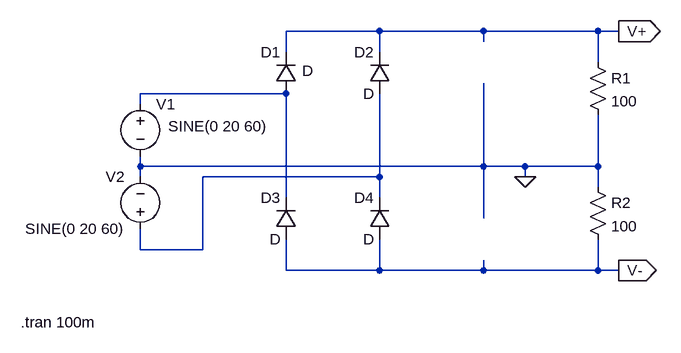
[diagram p0: schematic Draft1.asc]
Draft1.asc, the LTspice schematic file:
Version 4
SHEET 1 924 680
WIRE 464 32 320 32
WIRE 624 32 464 32
WIRE 800 32 624 32
WIRE 832 32 800 32
WIRE 624 48 624 32
WIRE 320 64 320 32
WIRE 464 64 464 32
WIRE 800 80 800 32
WIRE 320 128 96 128
WIRE 96 144 96 128
WIRE 96 240 96 224
WIRE 624 240 624 112
WIRE 624 240 96 240
WIRE 688 240 624 240
WIRE 800 240 800 160
WIRE 800 240 688 240
WIRE 96 256 96 240
WIRE 464 256 464 128
WIRE 464 256 192 256
WIRE 688 256 688 240
WIRE 800 272 800 240
WIRE 320 288 320 128
WIRE 464 288 464 256
WIRE 624 320 624 240
WIRE 96 368 96 336
WIRE 192 368 192 256
WIRE 192 368 96 368
WIRE 320 400 320 352
WIRE 464 400 464 352
WIRE 464 400 320 400
WIRE 624 400 624 384
WIRE 624 400 464 400
WIRE 800 400 800 352
WIRE 800 400 624 400
WIRE 832 400 800 400
FLAG 688 256 0
FLAG 832 32 V+
IOPIN 832 32 Out
FLAG 832 400 V-
IOPIN 832 400 Out
SYMBOL voltage 96 128 R0
WINDOW 3 43 50 Left 2
WINDOW 123 0 0 Left 0
WINDOW 39 0 0 Left 0
SYMATTR InstName V1
SYMATTR Value SINE(0 20 60)
SYMBOL voltage 96 352 R180
WINDOW 0 24 96 Left 2
WINDOW 3 24 16 Left 2
WINDOW 123 0 0 Left 0
WINDOW 39 0 0 Left 0
SYMATTR InstName V2
SYMATTR Value SINE(0 20 60)
SYMBOL diode 336 128 R180
WINDOW 0 24 64 Left 2
WINDOW 3 -26 35 Left 2
SYMATTR InstName D1
SYMBOL diode 480 128 R180
WINDOW 0 24 64 Left 2
WINDOW 3 24 0 Left 2
SYMATTR InstName D2
SYMBOL diode 336 352 R180
WINDOW 0 24 64 Left 2
WINDOW 3 24 0 Left 2
SYMATTR InstName D3
SYMBOL diode 480 352 R180
WINDOW 0 24 64 Left 2
WINDOW 3 24 0 Left 2
SYMATTR InstName D4
SYMBOL res 784 64 R0
SYMATTR InstName R1
SYMATTR Value 100
SYMBOL res 784 256 R0
SYMATTR InstName R2
SYMATTR Value 100
TEXT -88 480 Left 2 !.tran 100m

The netlist it stands for:
* Draft1.asc
V1 N001 0 SINE(0 20 60)
V2 N002 0 SINE(0 20 60)
D1 N001 V+ D
D2 N002 V+ D
D3 V- N001 D
D4 V- N002 D
R1 V+ 0 100
R2 0 V- 100
.model D D
.lib standard.dio
.tran 100m
.backanno
.end